# EasyEDA schematic SCH_glacierone_2023-07-03.json

## Sheets
1 Headers: TITLE: Glacier One T0 Headers; REV: 2.0; Date: 2022-11-26; Sheet: 1/1; Drawn By: Johnny Stene; Company: Glacier Project
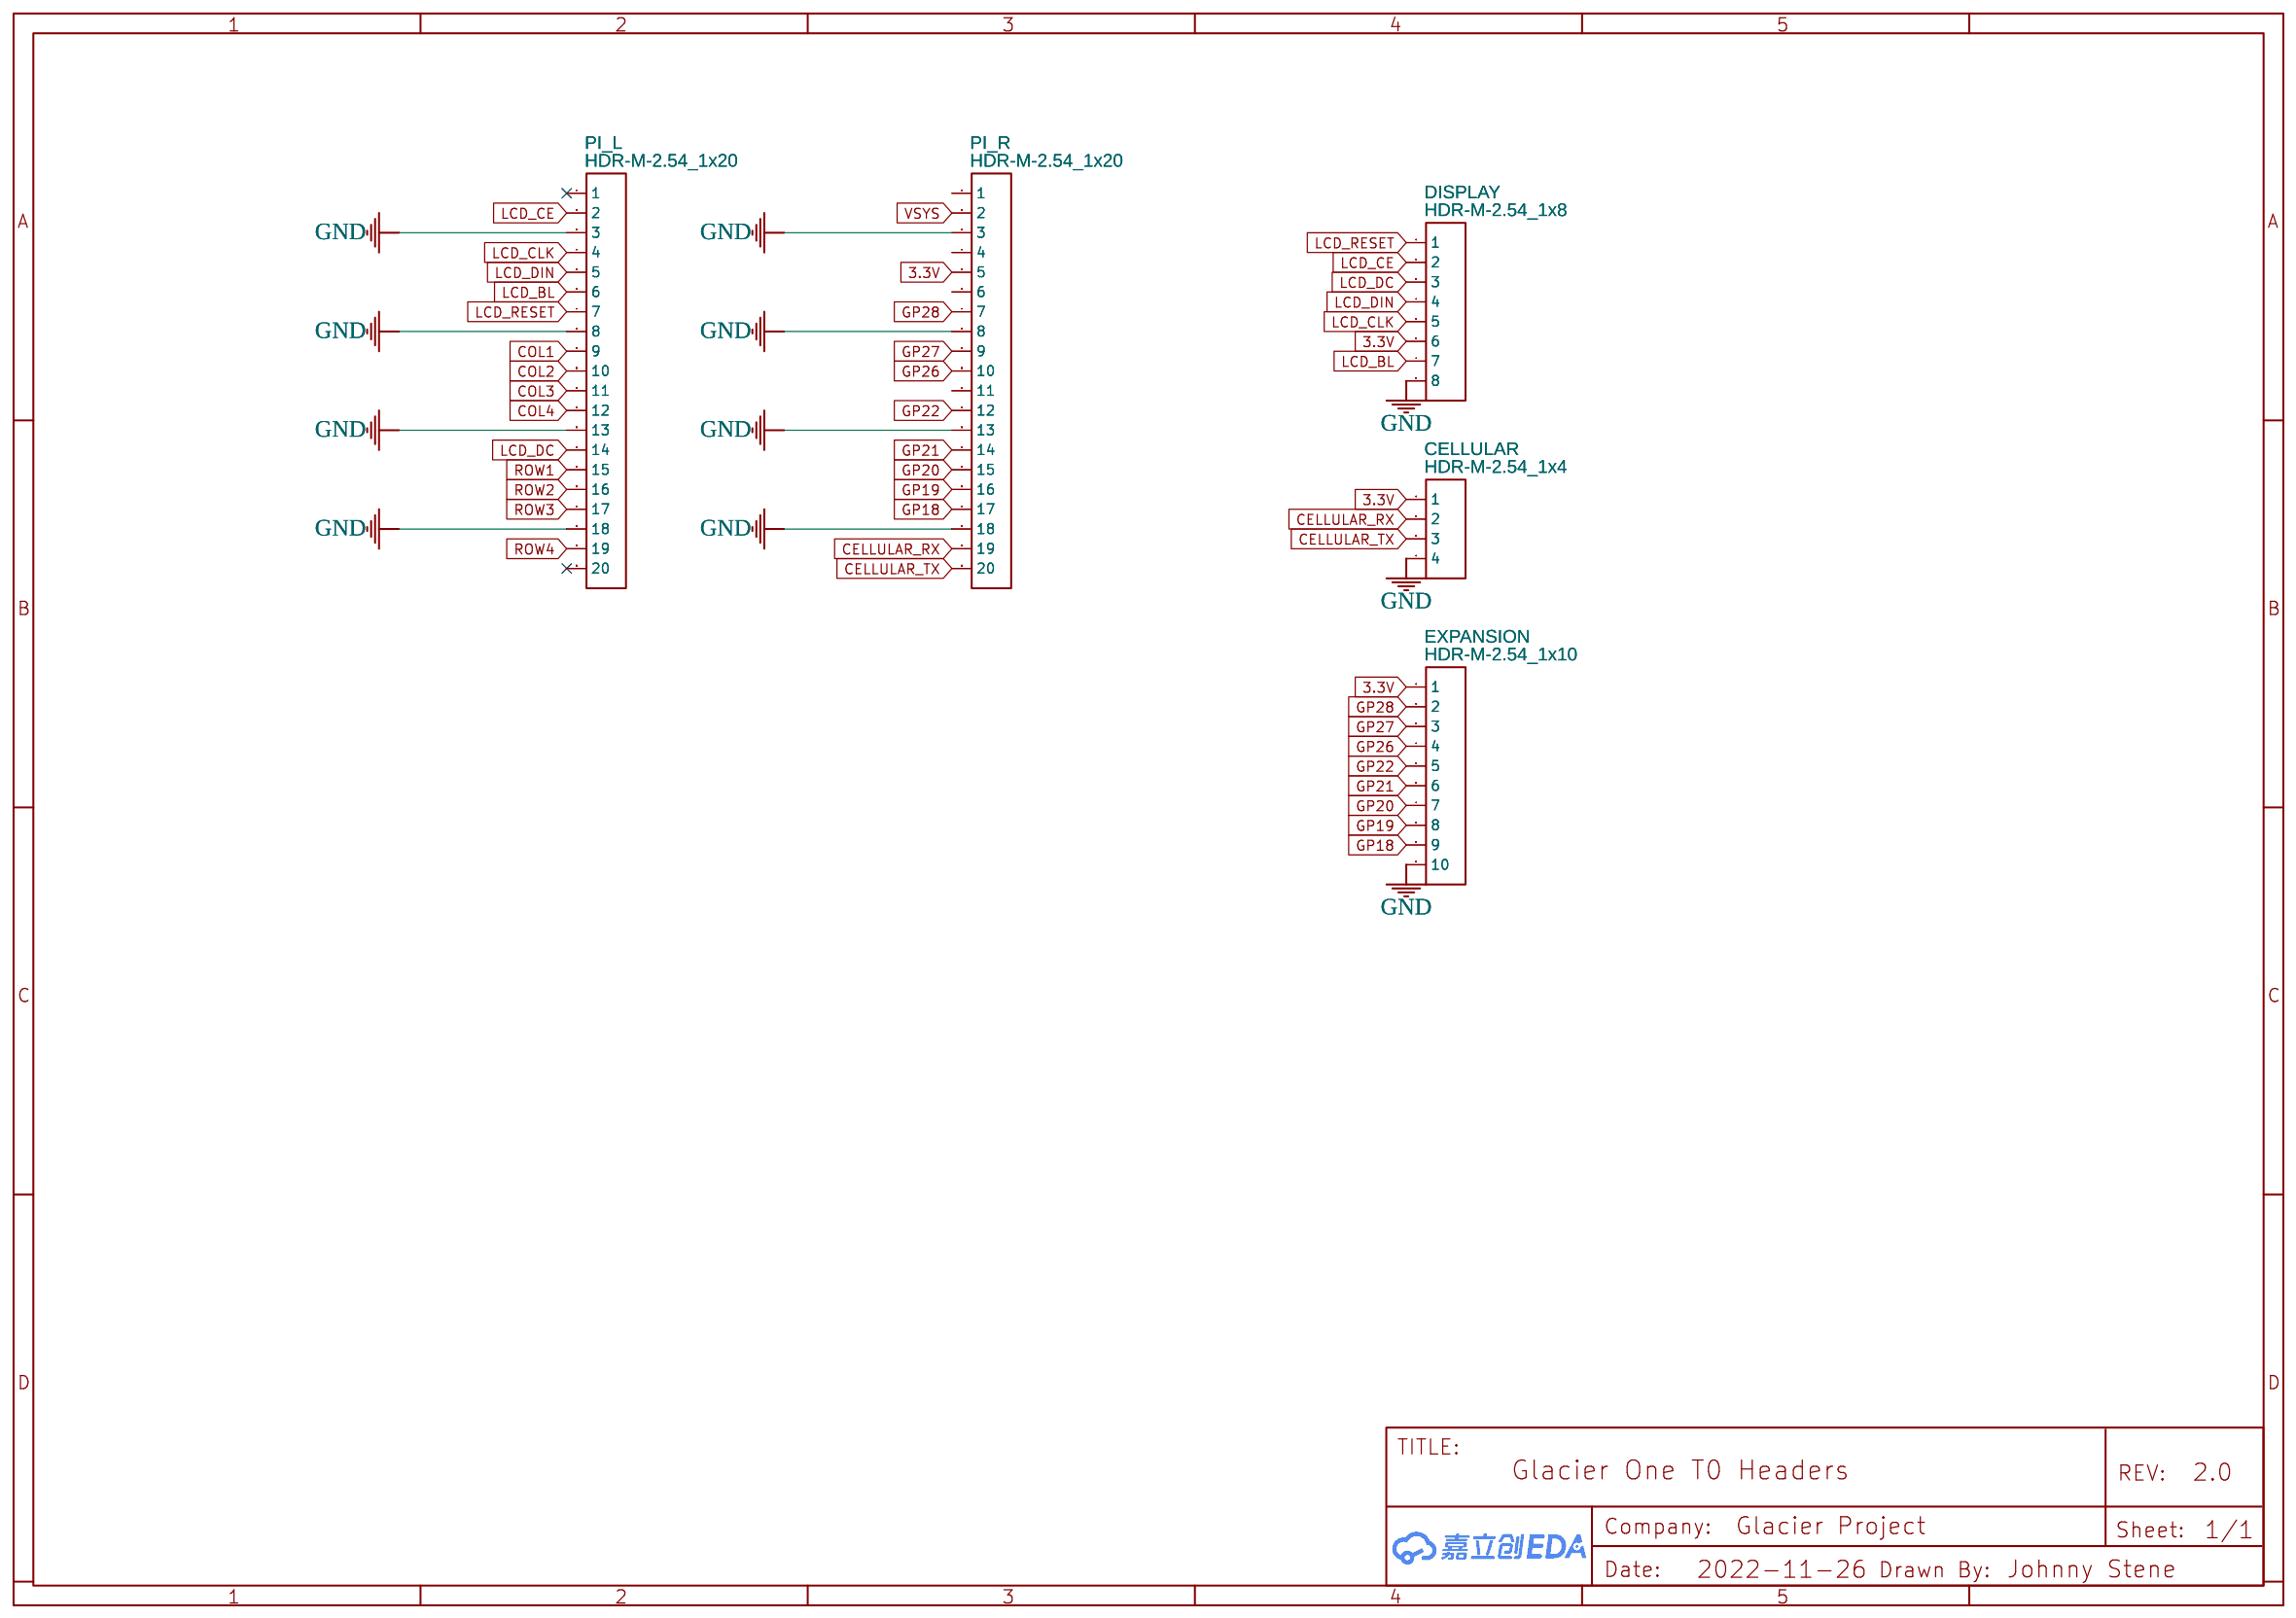
[diagram p0: Headers]
2 Keypad: TITLE: Glacier One T0 Keypad; Date: 2023-07-03
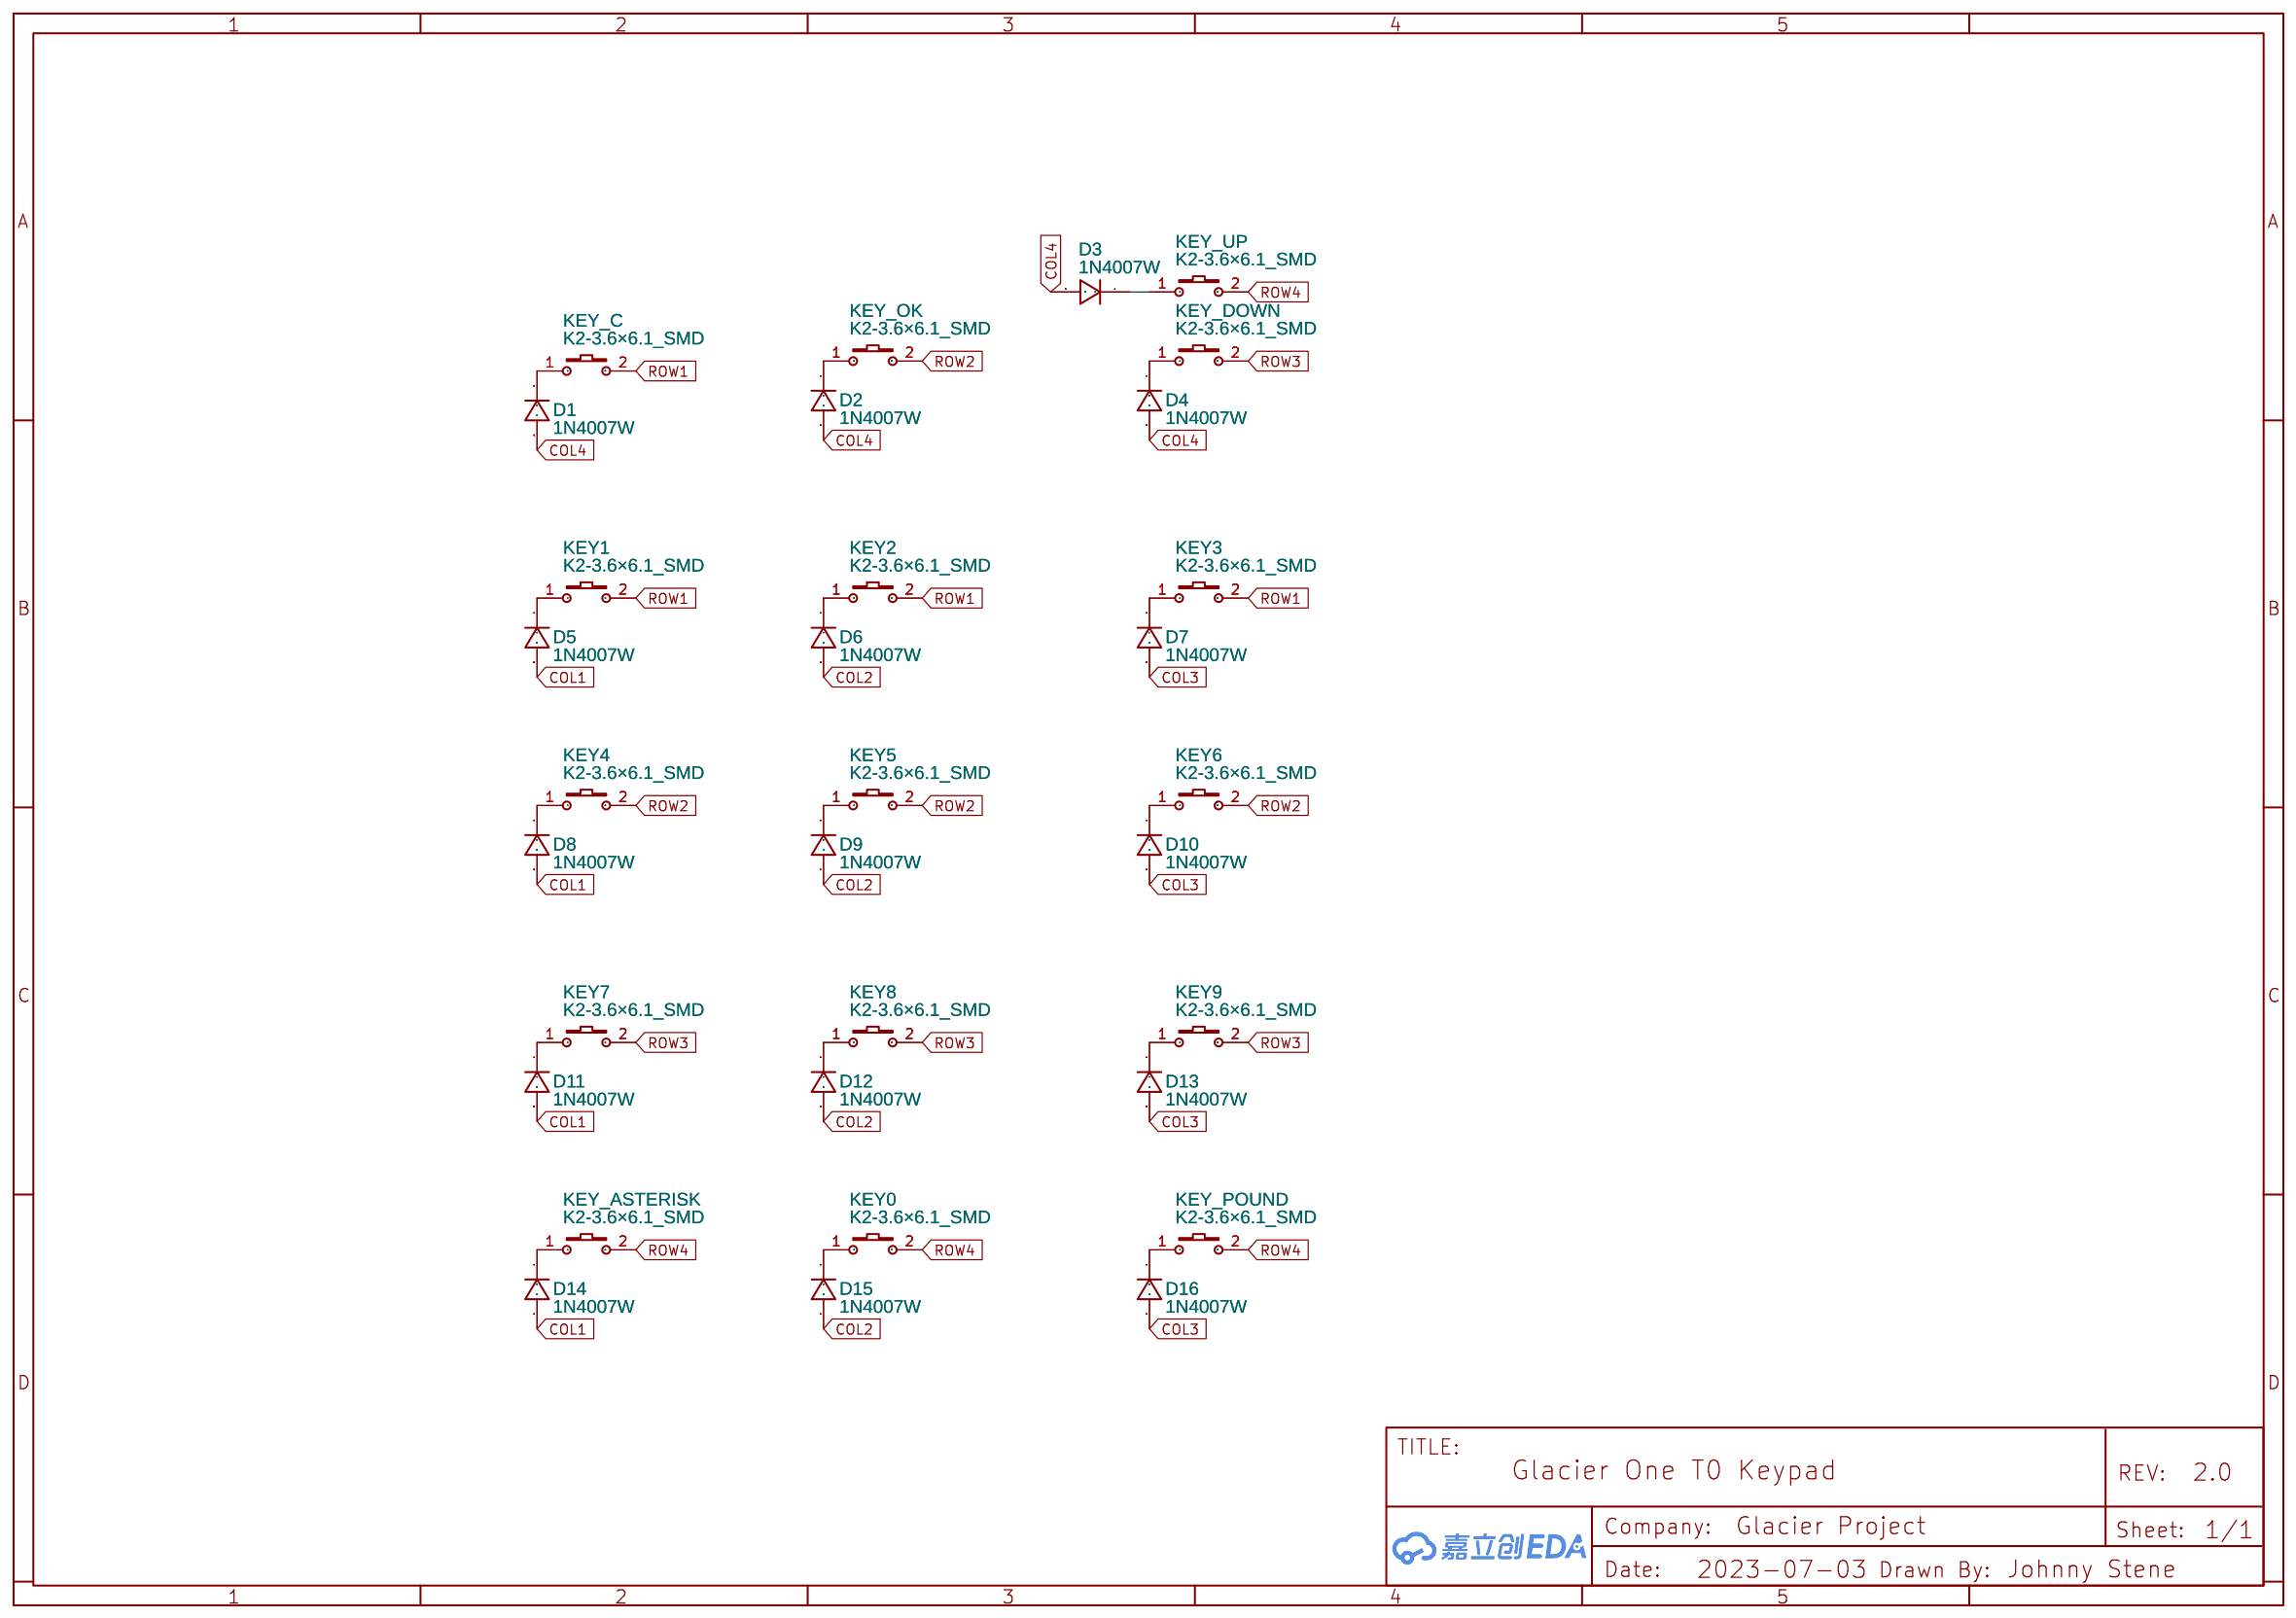
[diagram p1: Keypad]

## Parts
sheet Headers
CELLULAR  HDR-M-2.54_1x4  [HDR-M-2.54_1X4]
DISPLAY  HDR-M-2.54_1x8  [HDR-M-2.54_1X8]
EXPANSION  HDR-M-2.54_1x10  [HDR-M-2.54_1X10]
PI_L  HDR-M-2.54_1x20  [HDR-M-2.54_1X20]
PI_R  HDR-M-2.54_1x20  [HDR-M-2.54_1X20]
sheet Keypad
D1  1N4007W  [SOD-123_L2.8-W1.8-LS3.7-RD]
D2  1N4007W  [SOD-123_L2.8-W1.8-LS3.7-RD]
D3  1N4007W  [SOD-123_L2.8-W1.8-LS3.7-RD]
D4  1N4007W  [SOD-123_L2.8-W1.8-LS3.7-RD]
D5  1N4007W  [SOD-123_L2.8-W1.8-LS3.7-RD]
D6  1N4007W  [SOD-123_L2.8-W1.8-LS3.7-RD]
D7  1N4007W  [SOD-123_L2.8-W1.8-LS3.7-RD]
D8  1N4007W  [SOD-123_L2.8-W1.8-LS3.7-RD]
D9  1N4007W  [SOD-123_L2.8-W1.8-LS3.7-RD]
D10  1N4007W  [SOD-123_L2.8-W1.8-LS3.7-RD]
D11  1N4007W  [SOD-123_L2.8-W1.8-LS3.7-RD]
D12  1N4007W  [SOD-123_L2.8-W1.8-LS3.7-RD]
D13  1N4007W  [SOD-123_L2.8-W1.8-LS3.7-RD]
D14  1N4007W  [SOD-123_L2.8-W1.8-LS3.7-RD]
D15  1N4007W  [SOD-123_L2.8-W1.8-LS3.7-RD]
D16  1N4007W  [SOD-123_L2.8-W1.8-LS3.7-RD]
KEY0  K2-3.6×6.1_SMD  [KEY-SMD_2P-L6.2-W3.6-LS8.0]
KEY1  K2-3.6×6.1_SMD  [KEY-SMD_2P-L6.2-W3.6-LS8.0]
KEY2  K2-3.6×6.1_SMD  [KEY-SMD_2P-L6.2-W3.6-LS8.0]
KEY3  K2-3.6×6.1_SMD  [KEY-SMD_2P-L6.2-W3.6-LS8.0]
KEY4  K2-3.6×6.1_SMD  [KEY-SMD_2P-L6.2-W3.6-LS8.0]
KEY5  K2-3.6×6.1_SMD  [KEY-SMD_2P-L6.2-W3.6-LS8.0]
KEY6  K2-3.6×6.1_SMD  [KEY-SMD_2P-L6.2-W3.6-LS8.0]
KEY7  K2-3.6×6.1_SMD  [KEY-SMD_2P-L6.2-W3.6-LS8.0]
KEY8  K2-3.6×6.1_SMD  [KEY-SMD_2P-L6.2-W3.6-LS8.0]
KEY9  K2-3.6×6.1_SMD  [KEY-SMD_2P-L6.2-W3.6-LS8.0]
KEY_ASTERISK  K2-3.6×6.1_SMD  [KEY-SMD_2P-L6.2-W3.6-LS8.0]
KEY_C  K2-3.6×6.1_SMD  [KEY-SMD_2P-L6.2-W3.6-LS8.0]
KEY_DOWN  K2-3.6×6.1_SMD  [KEY-SMD_2P-L6.2-W3.6-LS8.0]
KEY_OK  K2-3.6×6.1_SMD  [KEY-SMD_2P-L6.2-W3.6-LS8.0]
KEY_POUND  K2-3.6×6.1_SMD  [KEY-SMD_2P-L6.2-W3.6-LS8.0]
KEY_UP  K2-3.6×6.1_SMD  [KEY-SMD_2P-L6.2-W3.6-LS8.0]

## Library data of the parts
CELLULAR = HDR-M-2.54_1x4: Supplier Part: C124378; Supplier: LCSC; Contributor: LCEDA_Lib
DISPLAY = HDR-M-2.54_1x8: Supplier Part: C190820; Supplier: LCSC; Contributor: LCEDA_Lib
EXPANSION = HDR-M-2.54_1x10: Supplier Part: C57369; Supplier: LCSC; Contributor: LCEDA_Lib
PI_L PI_R = HDR-M-2.54_1x20: Supplier Part: C50981; Supplier: LCSC; Contributor: LCEDA_Lib
D1-D16 = 1N4007W: Supplier: LCSC; Supplier Part: C328592; Manufacturer: BLUE ROCKET; Contributor: LCEDA_Lib
KEY0-KEY9 KEY_ASTERISK KEY_C KEY_DOWN KEY_OK KEY_POUND KEY_UP = K2-3.6×6.1_SMD: Supplier Part: C118141; Supplier: LCSC; Manufacturer Part: K2-1107ST-A4SW-06; Contributor: LCEDA_Lib; 制造商: 韩国韩荣

## Nets
3.3V: CELLULAR.1 DISPLAY.6 EXPANSION.1 PI_R.5
GND: CELLULAR.4 DISPLAY.8 EXPANSION.10 PI_L.3 PI_L.8 PI_L.13 PI_L.18 PI_R.3 PI_R.8 PI_R.13 PI_R.18
CELLULAR_RX: CELLULAR.2 PI_R.19
CELLULAR_TX: CELLULAR.3 PI_R.20
COL1: D5.2 D8.2 D11.2 D14.2 PI_L.9
COL2: D6.2 D9.2 D12.2 D15.2 PI_L.10
COL3: D7.2 D10.2 D13.2 D16.2 PI_L.11
COL4: D1.2 D2.2 D3.2 D4.2 PI_L.12
GP18: EXPANSION.9 PI_R.17
GP19: EXPANSION.8 PI_R.16
GP20: EXPANSION.7 PI_R.15
GP21: EXPANSION.6 PI_R.14
GP22: EXPANSION.5 PI_R.12
GP26: EXPANSION.4 PI_R.10
GP27: EXPANSION.3 PI_R.9
GP28: EXPANSION.2 PI_R.7
LCD_BL: DISPLAY.7 PI_L.6
LCD_CE: DISPLAY.2 PI_L.2
LCD_CLK: DISPLAY.5 PI_L.4
LCD_DC: DISPLAY.3 PI_L.14
LCD_DIN: DISPLAY.4 PI_L.5
LCD_RESET: DISPLAY.1 PI_L.7
ROW1: KEY1.2 KEY2.2 KEY3.2 KEY_C.2 PI_L.15
ROW2: KEY4.2 KEY5.2 KEY6.2 KEY_OK.2 PI_L.16
ROW3: KEY7.2 KEY8.2 KEY9.2 KEY_DOWN.2 PI_L.17
ROW4: KEY0.2 KEY_ASTERISK.2 KEY_POUND.2 KEY_UP.2 PI_L.19
VSYS: PI_R.2
Net-(D1-1): D1.1 KEY_C.1
Net-(D2-1): D2.1 KEY_OK.1
Net-(D3-1): D3.1 KEY_UP.1
Net-(D4-1): D4.1 KEY_DOWN.1
Net-(D5-1): D5.1 KEY1.1
Net-(D6-1): D6.1 KEY2.1
Net-(D7-1): D7.1 KEY3.1
Net-(D8-1): D8.1 KEY4.1
Net-(D9-1): D9.1 KEY5.1
Net-(D10-1): D10.1 KEY6.1
Net-(D11-1): D11.1 KEY7.1
Net-(D12-1): D12.1 KEY8.1
Net-(D13-1): D13.1 KEY9.1
Net-(D14-1): D14.1 KEY_ASTERISK.1
Net-(D15-1): D15.1 KEY0.1
Net-(D16-1): D16.1 KEY_POUND.1

Not connected (* = marked no-connect by the designer): PI_L 1* 20*; PI_R 1 4 6 11
